# Altium schematic sheet Sheet3.SchDoc
size A4; SheetNumber: 1; SheetTotal: 1
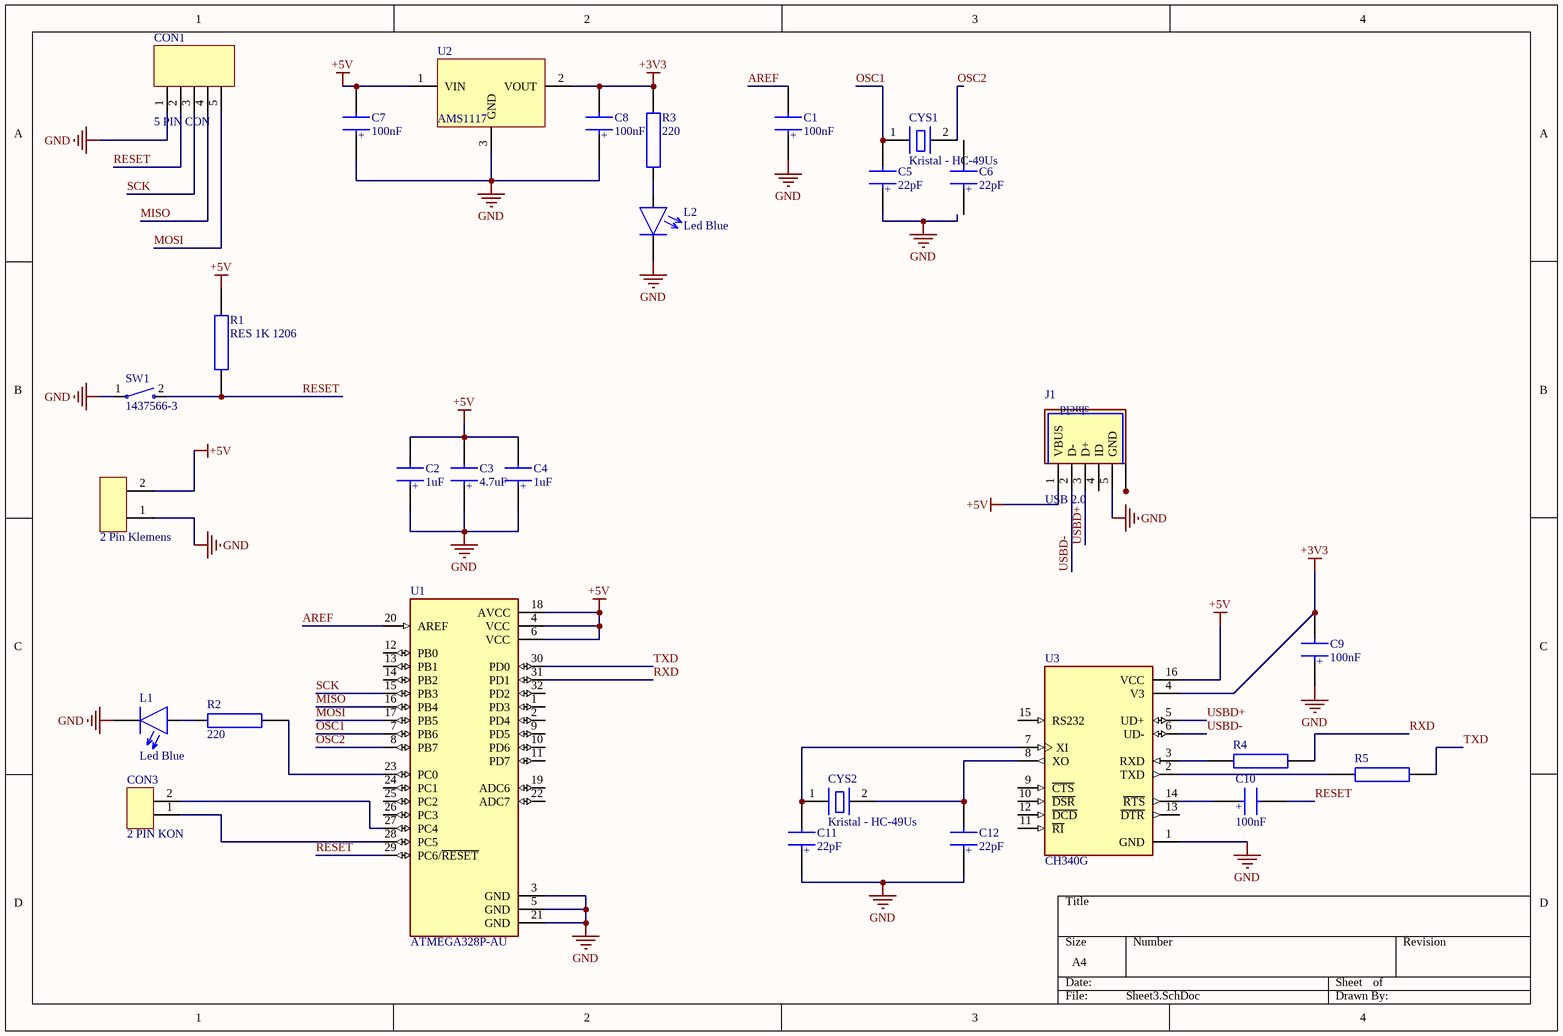
[diagram p0: Sheet3.SchDoc]

## Parts
C1  100nF  [CAP_805]
C2  1uF  [CAP_805]
C3  4.7uF  [CAP_805]
C4  1uF  [CAP_805]
C5  22pF  [CAP_805]
C6  22pF  [CAP_805]
C7  100nF  [CAP_805]
C8  100nF  [CAP_805]
C9  100nF  [CAP_805]
C10  100nF  [CAP_805]
C11  22pF  [CAP_805]
C12  22pF  [CAP_805]
CON1  5 PIN CON  [5 PIN 2.54MM]
CON3  2 PIN KON  [2 PIN 2.54MM]
CYS1  Kristal - HC-49Us  [Kristal - HC-49Us -smd]
CYS2  Kristal - HC-49Us  [Kristal - HC-49Us -smd]
J1  USB 2.0  [65100516121]
KLM1  2 Pin Klemens  [5.08mm-2 pin]
L1  Led Blue  [Led 1206]
L2  Led Blue  [Led 1206]
R1  RES 1K 1206  [RES_1206]
R2  220  [RES_1206]
R3  220  [RES_1206]
R4  RES 1K 1206  [RES_1206]  (value not drawn)
R5  RES 1K 1206  [RES_1206]  (value not drawn)
SW1  1437566-3  [SW_1437566-3]
U1  ATMEGA328P-AU  [QFP80P900X900X120-32N]
U2  AMS1117  [AMS1117]
U3  CH340G  [SOIC127P600X180-16N]

## Nets
+3V3: C8.2 C9.2 R3.2 U2.2(VOUT) U3.4(V3)
+5V: C2.2 C3.2 C4.2 C7.2 J1.1(VBUS) KLM1.2 R1.2 U1.4(VCC) U1.6(VCC) U1.18(AVCC) U2.1(VIN) U3.16(VCC)
GND: C1.1 C2.1 C3.1 C4.1 C5.1 C7.1 C8.1 C9.1 C11.1 C12.1 CON1.1 J1.5(GND) KLM1.1 L1.2 L2.2 SW1.1 U1.3(GND) U1.5(GND) U1.21(GND) U2.3(GND) U3.1(GND)
AREF: C1.2 U1.20(AREF)
MISO: CON1.4 U1.16(PB4)
MOSI: CON1.5 U1.17(PB5)
OSC1: C5.2 CYS1.1 U1.7(PB6)
OSC2: CYS1.2 U1.8(PB7)
RESET: C10.2 CON1.2 R1.1 SW1.2 U1.29(PC6/~{RESET})
RXD: R4.2 U1.31(PD1)
SCK: CON1.3 U1.15(PB3)
TXD: R5.2 U1.30(PD0)
USBD+: J1.3(D+) U3.5(UD+)
USBD-: J1.2(D-) U3.6(UD-)
NetC10_1: C10.1 U3.14(~{RTS})
NetC11_2: C11.2 CYS2.1 U3.7(XI)
NetC12_2: C12.2 CYS2.2 U3.8(XO)
NetCON3_1: CON3.1 U1.28(PC5)
NetCON3_2: CON3.2 U1.27(PC4)
NetJ1_S1: J1.S1(SHIELD) J1.S2(SHIELD) J1.S3(SHIELD) J1.S4(SHIELD)
NetL1_1: L1.1 R2.1
NetL2_1: L2.1 R3.1
NetR2_2: R2.2 U1.23(PC0)
NetR4_1: R4.1 U3.3(RXD)
NetR5_1: R5.1 U3.2(TXD)

Not connected (* = marked no-connect by the designer): C6 1 2; J1 4(ID); U1 1(PD3) 2(PD4) 9(PD5) 10(PD6) 11(PD7) 12(PB0) 13(PB1) 14(PB2) 19(ADC6) 22(ADC7) 24(PC1) 25(PC2) 26(PC3) 32(PD2); U3 9(~{CTS}) 10(~{DSR}) 11(~{RI}) 12(~{DCD}) 13(~{DTR}) 15(RS232)

## Notes on the sheet
- (in symbol CAP 22uf 0805) +
- (in symbol USB 2.0) shield

## Library data of the parts
C1-C12 = CAP 22uf 0805: 0805 smd
CON1 = 5 PIN CON: 2.54mm vertical connector
CON3 = 2 PIN KON: 2.54 mm vertical
CYS1 CYS2 = Kristal - HC-49Us: Smd tipi kristal
J1 = USB 2.0: USB - mini B USB 2.0 Receptacle Connector 5 Position Surface Mount, Right Angle; MF: WÃ¼rth Elektronik; MP: 65100516121; Purchase-URL: https://pricing.snapeda.com/search/part/65100516121/?ref=eda; SnapEDA_Link: https://www.snapeda.com/parts/65100516121/Wurth+Elektronik/view-part/?ref=snap; Price: None; Package: None; Value: *; Check_prices: https://www.snapeda.com/parts/65100516121/Wurth+Elektronik/view-part/?ref=eda; Availability: In Stock
KLM1 = 2 Pin Klemens: 5.08mm 2 pin klemens
R2 R3 = RES 1K 1206
SW1 = 1437566-3: Switch Tactile OFF (ON) SPST Rectangular Button Gull Wing 0.05A 12VDC SMD Loose Piece; Price: None; Value: *; Package: None; Availability: Unavailable; MP: 1437566-3
U1 = ATMEGA328P-AU: AVR AVRÂ® ATmega Microcontroller IC 8-Bit 20MHz 32KB (16K x 16) FLASH 32-TQFP (7x7); MF: Microchip Technology; Value: *; SnapEDA_Link: https://www.snapeda.com/parts/ATMEGA328P-AU/Microchip/view-part/?ref=snap; MP: ATMEGA328P-AU; Purchase-URL: https://pricing.snapeda.com/search/part/ATMEGA328P-AU/?ref=eda; Check_prices: https://www.snapeda.com/parts/ATMEGA328P-AU/Microchip/view-part/?ref=eda; Availability: In Stock; Price: None; Package: TQFP-32 Microchip
U2 = AMS1117: 3V3 Voltage Regulator; Iout: 1A; Vmax: 12V; Case/Package: SOT-89
U3 = CH340G: USB Interface Integrated Circuit; MF: WCH; Value: *; SnapEDA_Link: https://www.snapeda.com/parts/Ch340G/WCH/view-part/?ref=snap; MP: Ch340G; Check_prices: https://www.snapeda.com/parts/Ch340G/WCH/view-part/?ref=eda; Availability: Not in stock; Price: None; Package: None